# EAGLE design STEP-CON Mk 03 (EAGLE 7.5.0)
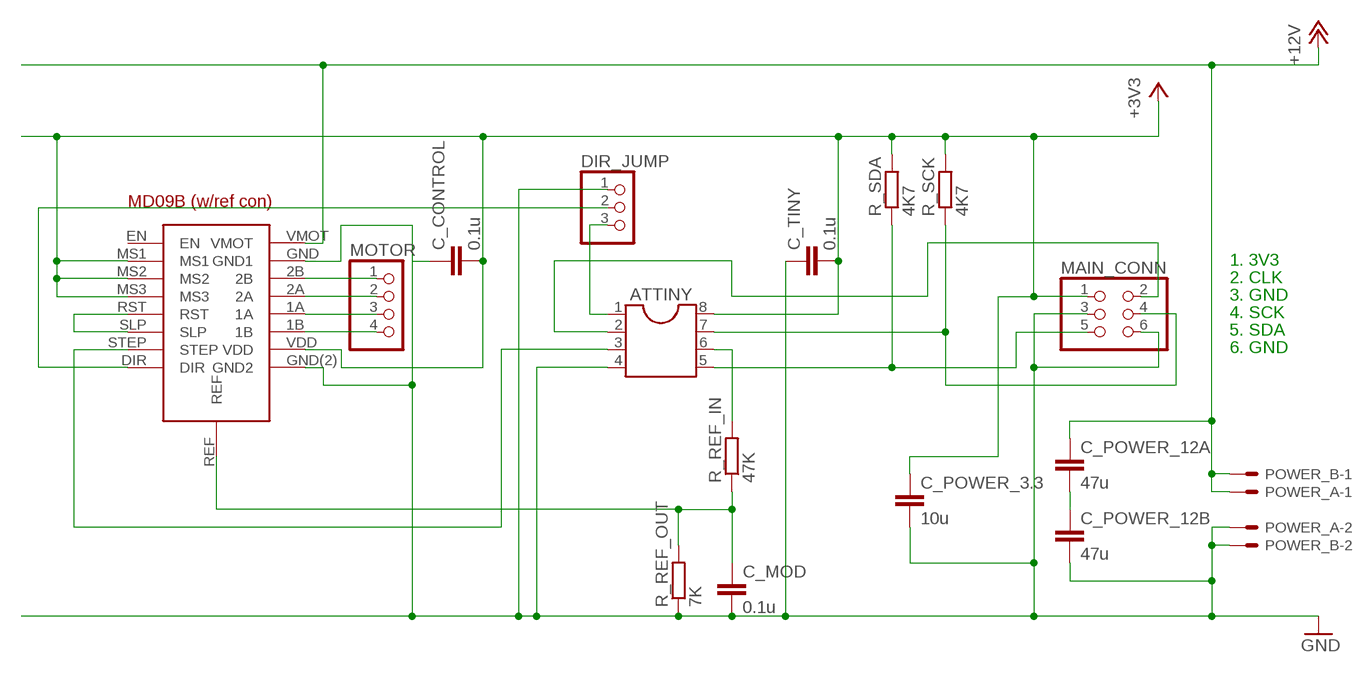
[diagram p0: schematic, sheet 1]

## Parts
ATTINY  DIL8  [DIL08]
C_CONTROL  0.1u  C-EUC1206  [C1206]
C_MOD  0.1u  C-EUC1206  [C1206]
C_POWER_3.3  10u  C-EUC1206  [C1206]
C_POWER_12A  47u  C-EUC1206  [C1206]
C_POWER_12B  47u  C-EUC1206  [C1206]
C_TINY  0.1u  C-EUC1206  [C1206]
DIR_JUMP  PINHD-1X3  [1X03]
MAIN_CONN  PINHD-2X3  [2X03]
MOTOR  PINHD-1X4  [1X04]
POWER_A  KK-156-2  [KK-156-2]
POWER_B  KK-156-2  [KK-156-2]
R_REF_IN  47K  R-EU_M0805  [M0805]
R_REF_OUT  7K  R-EU_M0805  [M0805]
R_SCK  4K7  R-EU_M0805  [M0805]
R_SDA  4K7  R-EU_M0805  [M0805]
U$1  MD09B_MOD_LP  [MD90B_MOD_LP]

## Nets
1A: MOTOR.3 U$1.1A
1B: MOTOR.4 U$1.1B
2A: MOTOR.2 U$1.2A
2B: MOTOR.1 U$1.2B
+3V3: ATTINY.8 C_CONTROL.2 C_POWER_3.3.1 C_TINY.2 MAIN_CONN.1 R_SCK.2 R_SDA.2 U$1.MS1 U$1.MS2 U$1.MS3 U$1.VDD
+12V: C_POWER_12A.1 POWER_A.1 POWER_B.1 U$1.VMOT
DIR: DIR_JUMP.2 U$1.DIR
GND: ATTINY.4 C_CONTROL.1 C_MOD.2 C_POWER_3.3.2 C_POWER_12B.2 C_TINY.1 DIR_JUMP.1 MAIN_CONN.3 MAIN_CONN.6 POWER_A.2 POWER_B.2 R_REF_OUT.1 U$1.GND(2)(GND2) U$1.GND(GND1)
N$1: C_POWER_12A.2 C_POWER_12B.1
PWM: ATTINY.6 R_REF_IN.2
REF: C_MOD.1 R_REF_IN.1 R_REF_OUT.2 U$1.REF
RESET/DIR: ATTINY.1 DIR_JUMP.3
RST_SLP: U$1.RST U$1.SLP
SCK: ATTINY.7 MAIN_CONN.4 R_SCK.1
SDA: ATTINY.5 MAIN_CONN.5 R_SDA.1
SKYCLOCK: ATTINY.2 MAIN_CONN.2
STEP: ATTINY.3 U$1.STEP
Unconnected: U$1.EN

## Notes on the sheet
- 1. 3V3
  2. CLK
  3. GND
  4. SCK
  5. SDA
  6. GND

## Library data of the parts
ATTINY = ic-package:DIL8: Dual In Line / Socket
C_CONTROL C_MOD C_POWER_3.3 C_POWER_12A C_POWER_12B C_TINY = rcl:C-EU: CAPACITOR, European symbol
DIR_JUMP = pinhead:PINHD-1X3: PIN HEADER
MAIN_CONN = pinhead - big pad:PINHD-2X3: PIN HEADER
MOTOR = pinhead:PINHD-1X4: PIN HEADER
POWER_A POWER_B = con-molex:KK-156-2: KK 156 HEADER Source: http://www.molex.com/pdm_docs/sd/026604100_sd.pdf; OC_FARNELL: unknown; OC_NEWARK: unknown
R_REF_IN R_REF_OUT R_SCK R_SDA = rcl:R-EU_: RESISTOR, European symbol
U$1 = pololu:MD09B_MOD_LP

## Board
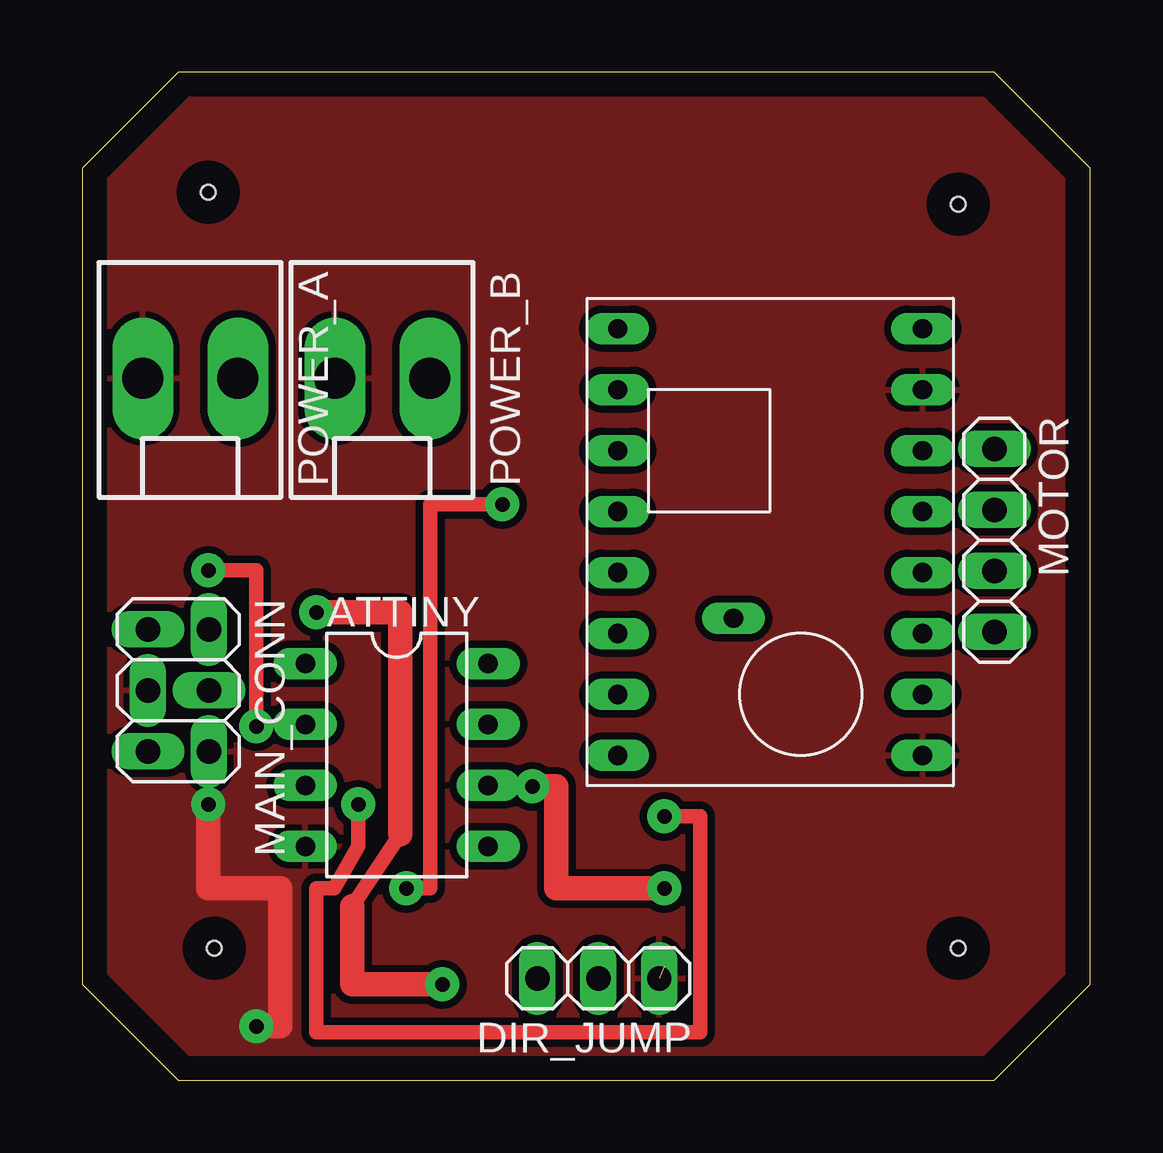
[diagram p1: board, top side]
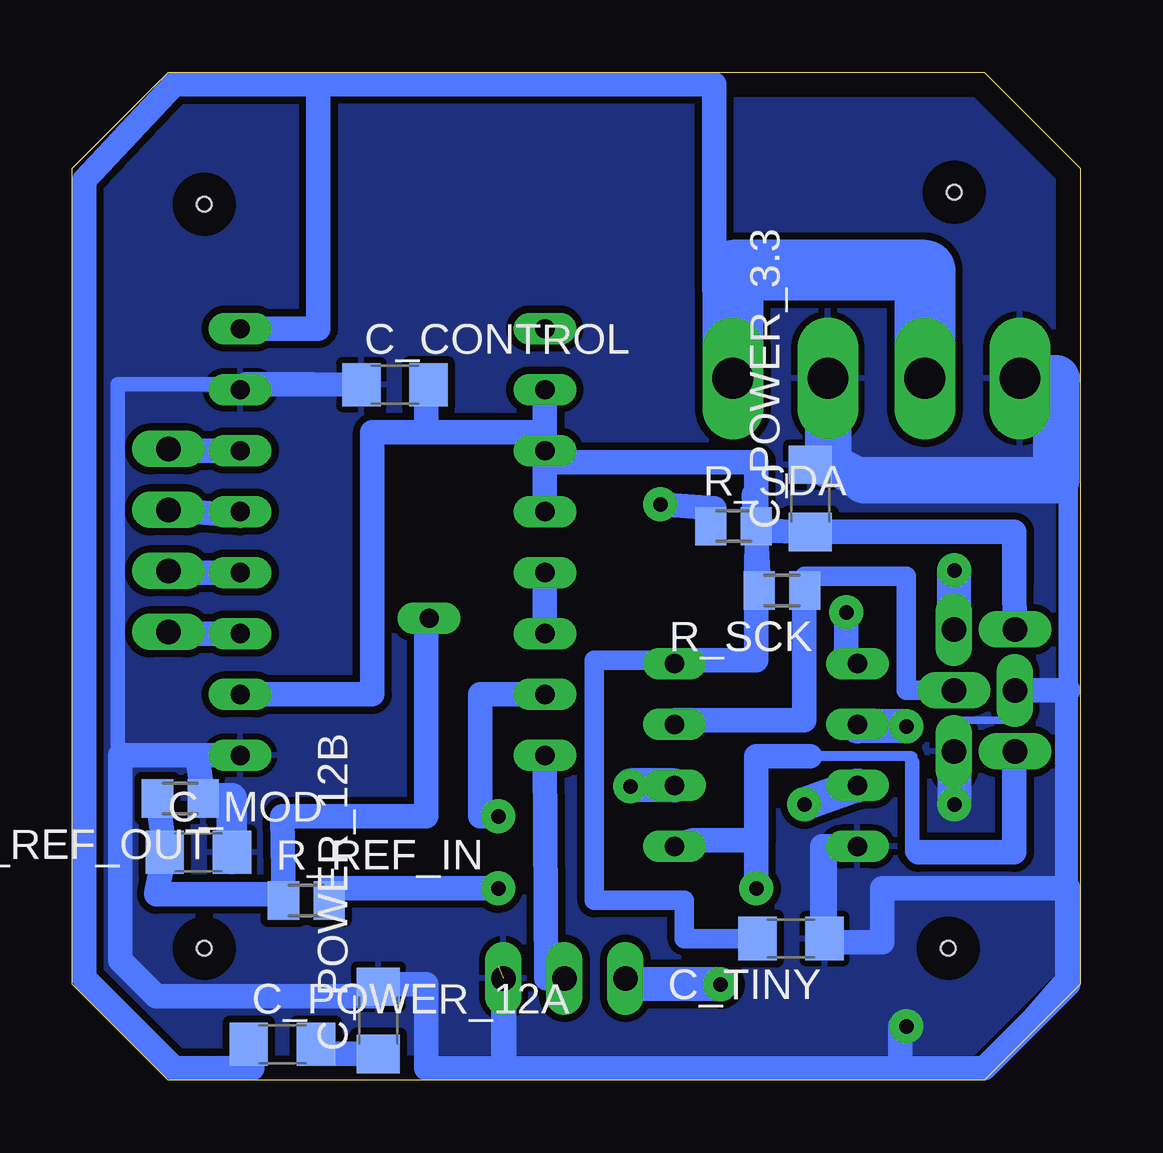
[diagram p2: board, bottom side, seen from below]

Size 42 x 42 mm. Coordinates in mm from the lower left corner, seen from the top.
Outline: 4,0 38,0 42,4 42,38 38,42 4,42 0,38 0,4 4,0
Copper layers (1*16): Top 0.035mm / dielectric 1.5mm / Bottom 0.035mm
Design rules "default *": minimum track width 10mil, minimum drill 24mil, track to track 12mil, track to pad 12mil, pad to pad 12mil, via to via 12mil, smd to smd 8mil, copper to edge 40mil, drill to drill 12mil, minimum pad ring 10mil, minimum via ring 8mil, stop-mask expansion 4mil, vias tented up to drill 0mil, thermal gap 10mil
Holes 0.6 mm at 5.5,5.5 5.25,37 36.5,36.5 36.5,5.5

### Footprints (pad centres in the part's own frame; a part is rotated, then mirrored left to right if it is on the bottom)
DIL08 = drill 0.813 long: 1 -3.81,-3.81; 2 -1.27,-3.81; 3 1.27,-3.81; 4 3.81,-3.81; 5 3.81,3.81; 6 1.27,3.81; 7 -1.27,3.81; 8 -3.81,3.81
C1206 = smd 1.6 x 1.8: 1 -1.4,0; 2 1.4,0
1X03 = drill 1.016 long: 1 -2.54,0; 2 0,0; 3 2.54,0
2X03 = drill 1.016 long: 1 -2.54,-1.27; 2 -2.54,1.27; 3 0,-1.27; 4 0,1.27; 5 2.54,-1.27; 6 2.54,1.27
1X04 = drill 1.016 long: 1 -3.81,0; 2 -1.27,0; 3 1.27,0; 4 3.81,0
KK-156-2 = drill 1.7 pad 2.184 long: 1 -1.98,0; 2 1.98,0
M0805 = smd 1.3 x 1.6: 1 -0.95,0; 2 0.95,0
MD90B_MOD_LP = drill 0.8 long: 1A 6.35,-1.27; 1B 6.35,-3.81; 2A 6.35,1.27; 2B 6.35,3.81; DIR -6.35,-8.89; EN -6.35,8.89; GND 6.35,6.35; GND(2) 6.35,-8.89; MS1 -6.35,6.35; MS2 -6.35,3.81; MS3 -6.35,1.27; REF -1.524,-3.175; RST -6.35,-1.27; SLP -6.35,-3.81; STEP -6.35,-6.35; VDD 6.35,-6.35; VMOT 6.35,8.89

### Placement (x,y rotation side)
ATTINY  13.1,13.56 270 top
C_CONTROL  28.56,28.99 0 bottom
C_MOD  36.75,9.5 0 bottom
C_POWER_3.3  11.25,24.25 90 bottom
C_POWER_12A  33.25,1.5 0 bottom
C_POWER_12B  29.25,2.5 90 bottom
C_TINY  12.06,5.91 180 bottom
DIR_JUMP  21.5,4.25 180 top
MAIN_CONN  4,16.25 270 top
MOTOR  38,22.5 270 top
POWER_A  4.5,29.25 180 top
POWER_B  12.5,29.25 180 top
R_REF_IN  32.25,7.5 0 bottom
R_REF_OUT  37.5,11.75 180 bottom
R_SCK  12.43,20.41 180 bottom
R_SDA  14.45,23.09 0 bottom
U$1  28.66,22.43 0 top

### Tracks (layer width: path | path; a pad name or v marks a point on that pad's centre or on a via)
1A
  Bottom 1.016: U$1.1A 38.25,21.16 MOTOR.3
1B
  Bottom 1.016: U$1.1B 38.25,18.62 MOTOR.4
2A
  Bottom 1.016: MOTOR.2 35.01,23.52 U$1.2A
2B
  Bottom 1.016: U$1.2B 38.25,26.24 MOTOR.1
+3V3
  Bottom 0.813: C_TINY.2 16.5,5.91 16.5,7.5 20.25,7.5 20.25,17.5 16.16,17.5
  Bottom 1.016: U$1.MS2 U$1.MS3 | U$1.VDD 29.5,16.08 29.5,27 27.25,27 | 27,28.99 C_CONTROL.2 27.25,28.99 27.25,27 | U$1.MS1 22.31,27 | 22.31,27 U$1.MS2 | MAIN_CONN.1 2.75,20.75 2.75,22.85 C_POWER_3.3.1 13.5,22.9 | 13.5,22.9 R_SDA.2 13.5,25.75 22.31,25.75 U$1.MS2 | 13.5,22.9 13.62,24.4 R_SCK.2 13.5,21.84 13.5,17.5 16.16,17.5 ATTINY.8 | 27.25,27 22.31,27
+12V
  Bottom 1.016: 31.75,41.5 15.25,41.5 15.25,33 POWER_B.1 | 31.75,41.5 37.75,41.5 41.5,37.5 41.5,4.25 37.75,0.5 34.5,0.5 34.5,1.5 C_POWER_12A.1 | 31.75,41.5 31.75,31.32 U$1.VMOT
  Bottom 2.54: POWER_B.1 14.48,33.75 6.48,33.75 POWER_A.1
DIR
  Bottom 1.016: U$1.DIR 22.31,13.5 22.25,4.25 DIR_JUMP.2
GND  (via drill 0.6 pad 1.42)  (1 unrouted)
  Top 1.016: v5.25,11.5 5.25,8 8.25,8 8.25,2.25 v7.25,2.25
  Bottom 0.254: 5.27,15 MAIN_CONN.6
  Bottom 0.305: 2.75,15 5.27,15
  Bottom 0.406: MAIN_CONN.6 5,13.71 4.75,13.75 | 3,15.5 3,16.25 2.75,16.25
  Bottom 0.61: 39.75,13.5 40.1,14 40.1,29 35.01,29 U$1.GND | 24.25,4.75 24.25,0.5 7.5,0.5 | 4,0.5 0.75,4.25 0.75,16.25
  Bottom 0.813: 0.5,29.25 0.5,16.25 0.5,8
  Bottom 1.016: 24,5 24,0.5 | 24,0.5 7.5,0.5 | 7.5,0.5 4,0.5 0.5,4 0.5,8 8.25,8 8.25,5.75 10.75,5.75 10.75,9.75 ATTINY.4 10.66,9.75 C_TINY.1 | C_CONTROL.1 30,28.99 32,29 34.76,29 U$1.GND | 2.75,16.25 MAIN_CONN.3 0.75,16.25 0.5,16.25 | POWER_B.2 10.5,29.25 | 39.75,13.5 40,13.54 | 24,0.5 24.25,0.5 27.25,0.5 27.25,4 29.25,4 C_POWER_12B.2 29.25,3.5 38.5,3.5 40,5 40,13.54 | 36.8,13.54 40,13.54 | U$1.GND(2) 36.8,13.54 | 36.8,13.54 R_REF_OUT.1 | 1,29.25 0.5,29.25 | v7.25,2.25 7.5,2.25 7.5,0.5 | C_POWER_3.3.2 10.25,25.65
  Bottom 1.27: R_REF_OUT.1 35.35,11.75 C_MOD.2 | C_POWER_3.3.2 10.5,25.65
  Bottom 1.422: MAIN_CONN.6 5.25,13.71 v5.25,11.5
  Bottom 1.676: 10.25,25.65 9,25
  Bottom 1.93: 10.5,29.25 10.5,25.65 | POWER_A.2 1,29.25 1,25 9,25
  pour Bottom: 0,4 4,0 38,0 42,4.25 42,37.5 37.75,42 4.25,42 0,38
  pour Bottom: 0,4 4,0 38,0 42,4.25 42,37.5 37.75,42 4.25,42 0,38
  pour Top: 0,4 4,0 38,0 42,4.25 42,37.5 37.75,42 4.25,42 0,38
N$1
  Bottom 1.016: C_POWER_12B.1 31.85,1.1 C_POWER_12A.2
PWM  (via drill 0.6 pad 1.42)
  Top 1.016: v18.75,12.25 19.75,12.25 19.75,8 v24.25,8
  Bottom 1.016: 18.75,12.29 v18.75,12.25 | v24.25,8 31.3,8 R_REF_IN.2
  Bottom 1.422: ATTINY.6 18.75,12.29
REF
  Bottom 1.016: U$1.REF 27.25,19.25 27.25,11 33.25,11 R_REF_IN.1 33.25,7.75 38.5,7.75 C_MOD.1 R_REF_OUT.2
RESET/DIR  (via drill 0.6 pad 1.42)
  Top 0.61: 13.25,10.25 11.25,7.25
  Top 1.016: v9.75,19.5 13.25,19.5 13.25,10.25 | 11.25,7.25 11.25,4 v15,4
  Bottom 1.016: ATTINY.1 9.75,17.37 v9.75,19.5 | 18.96,4 DIR_JUMP.3
  Bottom 1.422: v15,4 18.96,4
RST_SLP
  Bottom 1.016: U$1.RST U$1.SLP
SCK
  Bottom 0.813: MAIN_CONN.4 7.25,16.25 7.25,21 11.48,21 R_SCK.1
  Bottom 1.016: R_SCK.1 11.5,20.41 11.5,15 16.91,15 ATTINY.7
SDA  (via drill 0.6 pad 1.42)
  Top 0.61: v17.5,24 14.5,24 14.5,8 v13.5,8
  Bottom 0.406: 11.25,13.5 7,13.5 7,13.25
  Bottom 0.61: 6.75,9.5 7,9.5 7,13.25
  Bottom 1.016: MAIN_CONN.5 3,13.5 2.75,13.5 2.75,9.5 6.75,9.5 | 11.25,13.5 13.5,13.5 13.5,10 | 13.5,10 16.16,10 ATTINY.5 | v13.5,8 13.5,10 | R_SDA.1 15.25,23.84 v17.5,24
SKYCLOCK  (via drill 0.6 pad 1.42)
  Top 0.61: v5.25,21.25 7.25,21.25 v7.25,14.75
  Bottom 0.305: 9.29,15 ATTINY.2
  Bottom 1.016: MAIN_CONN.2 5.25,18.79 | 9.29,14.75 ATTINY.2
  Bottom 1.422: 5.25,18.79 v5.25,21.25 | v7.25,14.75 9.29,14.75
STEP  (via drill 0.6 pad 1.42)
  Top 0.61: v24.25,11 25.75,11 25.75,2 9.75,2 9.75,8 10.5,8 11.5,9.75 v11.5,11.5
  Bottom 1.016: U$1.STEP 25,16.08 25,11 v24.25,11
  Bottom 1.422: ATTINY.3 v11.5,11.5